# Altium schematic sheet [03] - CONNECTORS.SchDoc
size A4; DocumentNumber: 3; SheetNumber: 3; SheetTotal: 12
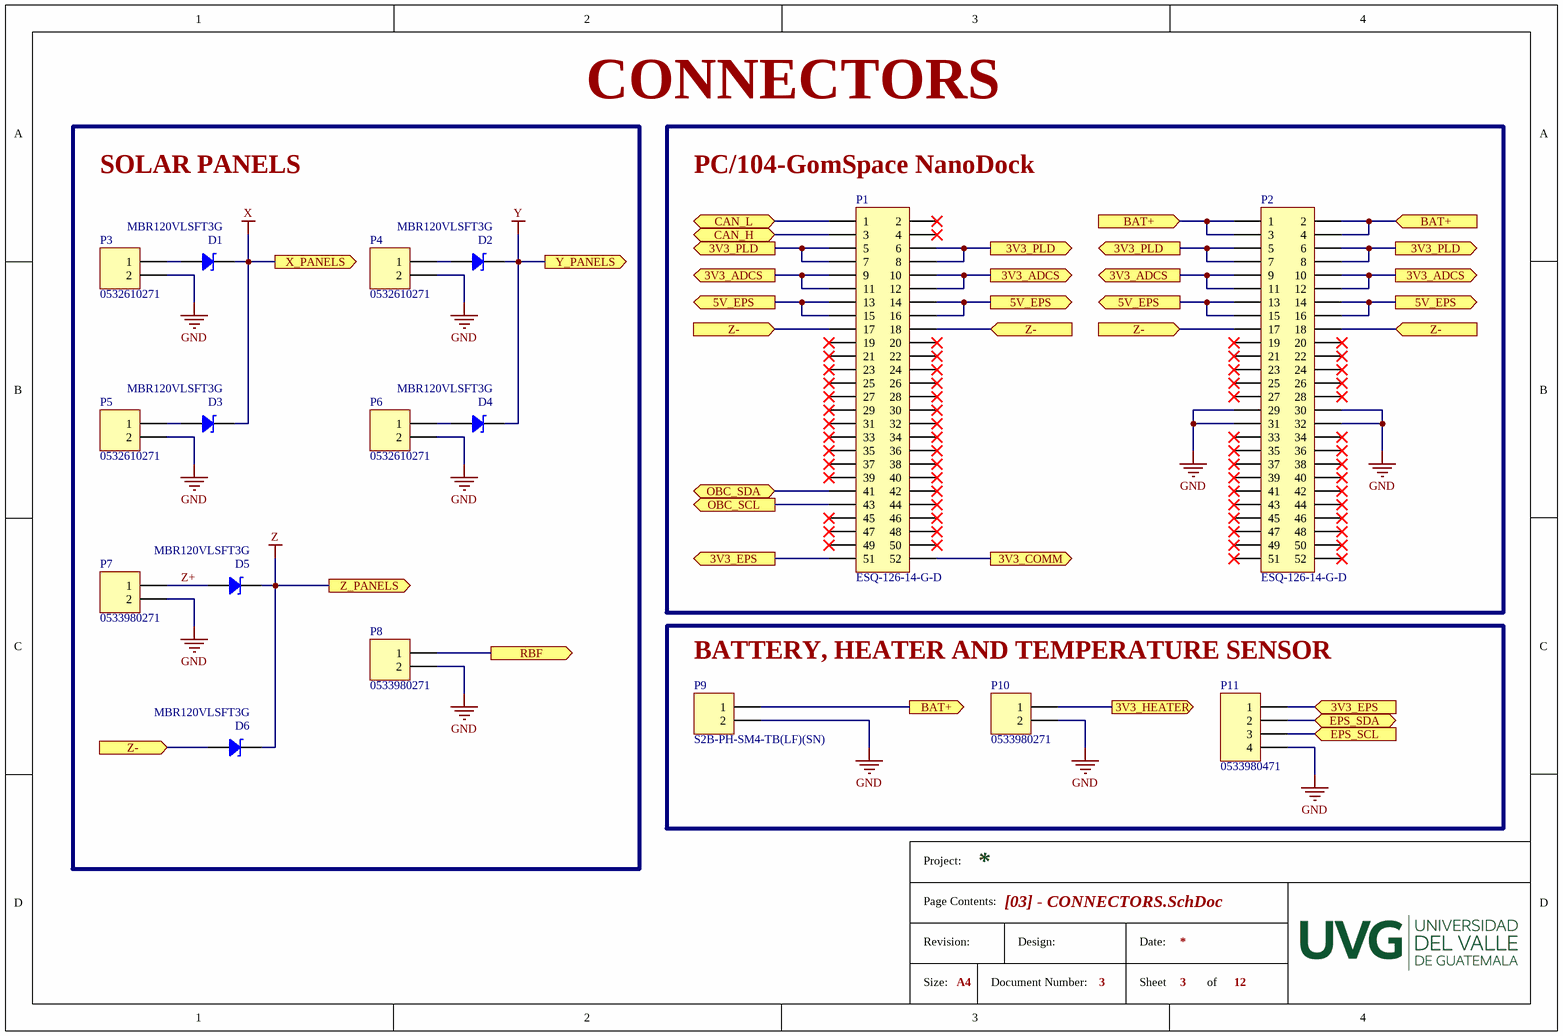
[diagram p0: [03] - CONNECTORS.SchDoc]

## Parts
D1  MBR120VLSFT3G  [SOD123F]
D2  MBR120VLSFT3G  [SOD123F]
D3  MBR120VLSFT3G  [SOD123F]
D4  MBR120VLSFT3G  [SOD123F]
D5  MBR120VLSFT3G  [SOD123F]
D6  MBR120VLSFT3G  [SOD123F]
P1  ESQ-126-14-G-D  [ESQ-126-14-G-D]
P2  ESQ-126-14-G-D  [ESQ-126-14-G-D]
P3  0532610271  [0532610271]
P4  0532610271  [0532610271]
P5  0532610271  [0532610271]
P6  0532610271  [0532610271]
P7  0533980271  [0533980271]
P8  0533980271  [0533980271]
P9  S2B-PH-SM4-TB(LF)(SN)  [S2B-PH-SM4-TB(LF)(SN)]
P10  0533980271  [0533980271]
P11  0533980471  [0533980471]

## Blocks framed on the sheet
CONNECTORS: D1-D6 P3-P8
PC/104-GomSpace NanoDock: P1 P2
BATTERY, HEATER AND TEMPERATURE SENSOR: P9-P11

## Ports
3V3_ADCS (out), 3V3_COMM (out), 3V3_EPS (in), 3V3_EPS (out), 3V3_HEATER (out), 3V3_PLD (out), 5V_EPS (out), BAT+ (in), BAT+ (out), CAN_H (bidir), CAN_L (bidir), EPS_SCL (in), EPS_SDA (bidir), OBC_SCL (out), OBC_SDA (bidir), RBF (out), X_PANELS (out), Y_PANELS (out), Z- (in), Z_PANELS (out)

## Nets
GND: P2.29 P2.30 P2.31 P2.32 P3.2 P4.2 P5.2 P6.2 P7.2 P8.2 P9.2 P10.2 P11.4
X: D1.2 D3.2 ; port X_PANELS
Y: D2.2 D4.2 ; port Y_PANELS
Z: D5.2 D6.2 ; port Z_PANELS
3V3_ADCS: P1.9 P1.10 P1.11 P1.12 P2.9 P2.10 P2.11 P2.12 ; port 3V3_ADCS
3V3_COMM: P1.52 ; port 3V3_COMM
3V3_EPS: P1.51 P11.1 ; port 3V3_EPS
3V3_HEATER: P10.1 ; port 3V3_HEATER
3V3_PLD: P1.5 P1.6 P1.7 P1.8 P2.5 P2.6 P2.7 P2.8 ; port 3V3_PLD
5V_EPS: P1.13 P1.14 P1.15 P1.16 P2.13 P2.14 P2.15 P2.16 ; port 5V_EPS
BAT+: P2.1 P2.2 P2.3 P2.4 P9.1 ; port BAT+
CAN_H: P1.3 ; port CAN_H
CAN_L: P1.1 ; port CAN_L
EPS_SCL: P11.3 ; port EPS_SCL
EPS_SDA: P11.2 ; port EPS_SDA
OBC_SCL: P1.43 ; port OBC_SCL
OBC_SDA: P1.41 ; port OBC_SDA
RBF: P8.1 ; port RBF
Z+: D5.1 P7.1
Z-: D6.1 P1.17 P1.18 P2.17 P2.18 ; port Z-
NetD1_1: D1.1 P3.1
NetD2_1: D2.1 P4.1
NetD3_1: D3.1 P5.1
NetD4_1: D4.1 P6.1

Not connected (* = marked no-connect by the designer): P1 2* 4* 19* 20* 21* 22* 23* 24* 25* 26* 27* 28* 29* 30* 31* 32* 33* 34* 35* 36* 37* 38* 39* 40* 42* 44* 45* 46* 47* 48* 49* 50*; P2 19* 20* 21* 22* 23* 24* 25* 26* 27* 28* 33* 34* 35* 36* 37* 38* 39* 40* 41* 42* 43* 44* 45* 46* 47* 48* 49* 50* 51* 52*

## Notes on the sheet
- SOLAR PANELS
- Project:
- Page Contents:
- Size:
- Revision:
- A4
- Document Number:
- Design:
- Date:
- Sheet
- of

## Library data of the parts
D1-D6 = MBR120VLSFT3G: DIODE SCHOTTKY 20V 1A SOD123FL; Manufacturer: ON Semiconductor; PCN Design/Specification: SOD123-FL Package Height 13/Sep/2013; Voltage - Forward (Vf) (Max) @ If: 340mV @ 1A; Speed: Fast Recovery =  200mA (Io); Current - Reverse Leakage @ Vr: 600µA @ 20V; Online Catalog: Schottky Diode; Other Names: MBR120VLSFT3GOSDKR; Supplier 1: Digi-Key; Manufacturer Part Number: MBR120VLSFT3G; Stock 1: 5944; Pricing 1: 1=0.42, 10=0.338, 100=0.2298, 500=0.1723, 1000=0.1293 (USD); Standard Package: 1; Category: Discrete Semiconductor Products; Family: Diodes, Rectifiers - Single; Series: -; Packaging: Digi-Reel®; Diode Type: Schottky; Voltage - DC Reverse (Vr) (Max): 20V; Current - Average Rectified (Io): 1A; Reverse Recovery Time (trr): -; Capacitance @ Vr, F: -; Mounting Type: Surface Mount; Package / Case: SOD-123F; Supplier Device Package: SOD-123FL; Operating Temperature - Junction: -65°C ~ 125°C; ComponentLink1URL: https://datasheet.ciiva.com/4715/mbr120vlsft1-d-107081-4715104.pdf; ComponentLink1Description: https://datasheet.ciiva.com/4715/mbr120vlsft1-d-107081-4715104.pdf; ComponentLink2URL: https://datasheet.ciiva.com/6380/mbr120vlsft1-d-6380907.pdf; ComponentLink2Description: https://datasheet.ciiva.com/6380/mbr120vlsft1-d-6380907.pdf; ComponentLink3URL: https://datasheet.ciiva.com/8294/mbr120vlsft1-d-8294603.pdf; ComponentLink3Description: https://datasheet.ciiva.com/8294/mbr120vlsft1-d-8294603.pdf; ComponentLink4URL: https://datasheet.ciiva.com/6380/mbr120vlsft1-d-6380910.pdf; ComponentLink4Description: https://datasheet.ciiva.com/6380/mbr120vlsft1-d-6380910.pdf; Supplier Part Number 1: MBR120VLSFT3GOSCT-ND
P1 P2 = ESQ-126-14-G-D: CONN SOCKET 52POS 0.1 GOLD PCB; Manufacturer: Samtec; Number of Contacts: 52; Gender: Receptacle; Max Current Rating: 6.9A; Contact Resistance: 10mR; Max Voltage Rating (AC): 550V; Pitch: 2.54mm; Supplier 1: Digi-Key; Manufacturer Part Number: ESQ-126-14-G-D; Stock 1: 520; Pricing 1: 1 = 9.64000, 10 = 8.91700, 100 = 7.47100, 500 = 6.26600, 1000 = 6.02500 (USD); RoHS: Yes; Contact Plating: Gold; Contact Material: Bronze; Housing Color: Black; Housing Material: Polyester; Min Operating Temperature: -55°C; Max Operating Temperature: 125°C; Number of Rows: 2; Termination: Solder; Packaging: Bulk; Orientation: Straight; Length: 66.55mm; Lead Pitch: 2.54mm; Depth: 4.95mm; Radiation Hardening: No; REACH SVHC: No SVHC; ComponentLink1URL: http://www.farnell.com/datasheets/1902536.pdf?src-supplier=Farnell; ComponentLink1Description: http://www.farnell.com/datasheets/1902536.pdf?src-supplier=Farnell; ComponentLink2URL: http://components.arrow.com/part/dataview/0323_04347871?src-supplier=Arrow+Europe; ComponentLink2Description: http://components.arrow.com/part/dataview/0323_04347871?src-supplier=Arrow+Europe; ComponentLink3URL: http://www.samtec.com/documents/webfiles/pdf/ESW_TH.PDF?src-supplier=Avnet+Europe; ComponentLink3Description: http://www.samtec.com/documents/webfiles/pdf/ESW_TH.PDF?src-supplier=Avnet+Europe; ComponentLink4URL: http://cloud.samtec.com/catalog_english/ESW_TH.PDF?src-supplier=Avnet; ComponentLink4Description: http://cloud.samtec.com/catalog_english/ESW_TH.PDF?src-supplier=Avnet; ComponentLink5URL: http://suddendocs.samtec.com/prints/esq-1xx-xx-x-x-xxx-xx-x-xx-mkt.pdf?src-supplier=Digi-Key; ComponentLink5Description: http://suddendocs.samtec.com/prints/esq-1xx-xx-x-x-xxx-xx-x-xx-mkt.pdf?src-supplier=Digi-Key; ComponentLink6URL: http://www.farnell.com/datasheets/1902536.pdf?src-supplier=Element14; ComponentLink6Description: http://www.farnell.com/datasheets/1902536.pdf?src-supplier=Element14; Supplier Part Number 1: SAM11114-ND
P3-P6 = 0532610271: CONN HEADER 2POS 1.25MM R/A SMD; Manufacturer: Molex; Manufacturer Part Number: 53261-0271; Voltage Rating: 125V; Gender: Male; Contact Resistance: 20mR; Current Rating: 1A; Number of Positions: 2; Insulation Resistance: 100MR; Glow Wire Compliant: Non-compliant; Supplier 1: Digi-Key; Stock 1: 34859; Pricing 1: 1 = 0.98000, 10 = 0.86000, 100 = 0.74170, 500 = 0.60688 (USD); RoHS: Yes; Mount: Surface Mount; Contact Material: Bronze; Contact Plating: Tin; Color: Beige; Housing Material: Thermoplastic; Min Operating Temperature: -40°C; Max Operating Temperature: 85°C; Packaging: Tape and Reel; Termination: SMD/SMT; Package Quantity: 1000; Number of Rows: 1; Number of Contacts: 2; Orientation: Right Angle; Voltage Rating (AC): 125V; Working Voltage: 125V; Number of Circuits: 2; Voltage Rating (DC): 125V; Pitch: 1.25mm; Lead Pitch: 1.25mm; Radiation Hardening: No; REACH SVHC: Unknown; Lead Free: Lead Free; Flammability Rating: UL94 V-0; ComponentLink1URL: https://datasheet.ciiva.com/11747/0900766b8078fc90-11747475.pdf?src-supplier=RSComponents; ComponentLink1Description: https://datasheet.ciiva.com/11747/0900766b8078fc90-11747475.pdf?src-supplier=RSComponents; ComponentLink2URL: https://datasheet.ciiva.com/5151/0532610271-pcb-headers-171053-5151611.pdf?src-supplier=Mouser; ComponentLink2Description: https://datasheet.ciiva.com/5151/0532610271-pcb-headers-171053-5151611.pdf?src-supplier=Mouser; ComponentLink3URL: https://datasheet.ciiva.com/7167/1626147-7167496.pdf?src-supplier=Newark; ComponentLink3Description: https://datasheet.ciiva.com/7167/1626147-7167496.pdf?src-supplier=Newark; ComponentLink4URL: https://datasheet.ciiva.com/30193/198270532610271-pcb-headers-30193321.pdf?src-supplier=Onlinecomponents.com; ComponentLink4Description: https://datasheet.ciiva.com/30193/198270532610271-pcb-headers-30193321.pdf?src-supplier=Onlinecomponents.com; ComponentLink5URL: https://datasheet.ciiva.com/34303/1932547-34303342.pdf?src-supplier=Jameco; ComponentLink5Description: https://datasheet.ciiva.com/34303/1932547-34303342.pdf?src-supplier=Jameco; ComponentLink6URL: https://datasheet.ciiva.com/16658/0532610271-pcb-headers-16658423.pdf?src-supplier=Avnet+Europe; ComponentLink6Description: https://datasheet.ciiva.com/16658/0532610271-pcb-headers-16658423.pdf?src-supplier=Avnet+Europe; ComponentLink7URL: https://datasheet.ciiva.com/17035/70091115-17035863.pdf?src-supplier=Allied+Electronics; ComponentLink7Description: https://datasheet.ciiva.com/17035/70091115-17035863.pdf?src-supplier=Allied+Electronics; ComponentLink8URL: https://datasheet.ciiva.com/46393/1808526-46393547.pdf?src-supplier=Element14; ComponentLink8Description: https://datasheet.ciiva.com/46393/1808526-46393547.pdf?src-supplier=Element14; ComponentLink9URL: https://datasheet.ciiva.com/7920/1887027-7920826.pdf?src-supplier=Element14; ComponentLink9Description: https://datasheet.ciiva.com/7920/1887027-7920826.pdf?src-supplier=Element14; ComponentLink10URL: https://datasheet.ciiva.com/9468/0532610271-pcb-headers-9468506.pdf?src-supplier=Avnet; ComponentLink10Description: https://datasheet.ciiva.com/9468/0532610271-pcb-headers-9468506.pdf?src-supplier=Avnet; ComponentLink11URL: https://datasheet.ciiva.com/22683/1626147-22683562.pdf?src-supplier=Element14; ComponentLink11Description: https://datasheet.ciiva.com/22683/1626147-22683562.pdf?src-supplier=Element14; Supplier Part Number 1: WM7620CT-ND
P7 P8 P10 = 0533980271: CONN HEADER 2POS 1.25MM VERT SMD; Manufacturer: Molex; Connector Type: Header, Shrouded; Number of Positions: 2; Number of Positions Loaded: All; Pitch: 0.049" (1.25mm); Supplier 1: Digi-Key; Manufacturer Part Number: 0533980271; Stock 1: 25214; Pricing 1: 1=0.88, 10=0.778, 100=0.6713, 500=0.5493 (USD); Category: Connectors, Interconnects; Family: Rectangular Connectors - Headers, Male Pins; Series: PicoBlade™ 53398; Packaging: Cut Tape (CT); Contact Type: Blade Pin; Number of Rows: 1; Row Spacing: -; Contact Mating Length: -; Mounting Type: Surface Mount; Termination: Solder; Fastening Type: -; Features: Solder Retention; Contact Finish: Tin; Contact Finish Thickness: 39µin (1.00µm); Color: Natural; ComponentLink1URL: https://datasheet.ciiva.com/6813/533980271-sd-6813860.pdf; ComponentLink1Description: https://datasheet.ciiva.com/6813/533980271-sd-6813860.pdf; ComponentLink2URL: https://datasheet.ciiva.com/3117/0533980271-pcb-headers-3117624.pdf; ComponentLink2Description: https://datasheet.ciiva.com/3117/0533980271-pcb-headers-3117624.pdf; ComponentLink3URL: https://datasheet.ciiva.com/3117/0533980271-pcb-headers-3117625.pdf; ComponentLink3Description: https://datasheet.ciiva.com/3117/0533980271-pcb-headers-3117625.pdf; ComponentLink4URL: https://datasheet.ciiva.com/6813/533980271-sd-6813869.pdf; ComponentLink4Description: https://datasheet.ciiva.com/6813/533980271-sd-6813869.pdf; Supplier Part Number 1: WM7606CT-ND
P9 = S2B-PH-SM4-TB(LF)(SN): CONN HEADER PH SIDE 2POS 2MM SMD; Manufacturer: JST; No of Positions: 2; Style/Orientation: Right Angle Header/Plug; Supplier 1: Digi-Key; Manufacturer Part Number: S2B-PH-SM4-TB(LF)(SN); Stock 1: 113530; Pricing 1: 1=0.58, 10=0.547, 100=0.4194, 500=0.3647 (USD); Pitch: 2 mm; Type: Shrouded Header; Termination: Crimp; ComponentLink1URL: https://datasheet.ciiva.com/11747/0900766b80df0d9d-11747104.pdf; ComponentLink1Description: https://datasheet.ciiva.com/11747/0900766b80df0d9d-11747104.pdf; ComponentLink2URL: https://datasheet.ciiva.com/712/eph-712514.pdf; ComponentLink2Description: https://datasheet.ciiva.com/712/eph-712514.pdf; ComponentLink3URL: https://datasheet.ciiva.com/712/eph-712515.pdf; ComponentLink3Description: https://datasheet.ciiva.com/712/eph-712515.pdf; ComponentLink4URL: https://datasheet.ciiva.com/712/eph-712516.pdf; ComponentLink4Description: https://datasheet.ciiva.com/712/eph-712516.pdf; ComponentLink5URL: https://datasheet.ciiva.com/16199/s2b-ph-sm4-tblfsn-16199686.pdf; ComponentLink5Description: https://datasheet.ciiva.com/16199/s2b-ph-sm4-tblfsn-16199686.pdf; ComponentLink6URL: https://datasheet.ciiva.com/26894/getdatasheetpartid-406256-26894907.pdf; ComponentLink6Description: https://datasheet.ciiva.com/26894/getdatasheetpartid-406256-26894907.pdf; Supplier Part Number 1: 455-1749-1-ND
P11 = 0533980471: CONN HEADER 4POS 1.25MM VERT SMD; Manufacturer: Molex; Manufacturer Part Number: 53398-0471; Body Plating: Tin; Gender: Male; Current Rating: 1A; Voltage Rating: 125V; Number of Positions: 4; Contact Resistance: 20mR; Insulation Resistance: 100MR; Glow Wire Compliant: Non-compliant; Supplier 1: Digi-Key; Stock 1: 49208; Pricing 1: 1=1.19, 10=1.044, 100=0.901, 500=0.73716 (USD); Mount: Surface Mount; Colour: Natural; Housing Colour: Natural; Housing Material: Nylon; Contact Plating: Tin; Contact Material: Bronze,Brass,Tin; Min Operating Temperature: -40°C; Max Operating Temperature: 85°C; Packaging: Tape and Reel; Termination: Solder; Number of Rows: 1; Package Quantity: 1000; Number of Contacts: 4; Orientation: Vertical; Voltage Rating (AC): 125V; Working Voltage: 125V; Number of Circuits: 4; Voltage Rating (DC): 125V; Pitch: 1.25mm; Lead Pitch: 1.25mm; Radiation Hardening: No; REACH SVHC: Unknown; Lead Free: Lead Free; Flammability Rating: UL94 V-0; ComponentLink1URL: https://datasheet.ciiva.com/5154/0533980471-pcb-headers-171069-5154864.pdf; ComponentLink1Description: https://datasheet.ciiva.com/5154/0533980471-pcb-headers-171069-5154864.pdf; ComponentLink2URL: https://datasheet.ciiva.com/39121/1932627-39121616.pdf; ComponentLink2Description: https://datasheet.ciiva.com/39121/1932627-39121616.pdf; ComponentLink3URL: https://datasheet.ciiva.com/23964/0533980471-pcb-headers-23964130.pdf; ComponentLink3Description: https://datasheet.ciiva.com/23964/0533980471-pcb-headers-23964130.pdf; ComponentLink4URL: https://datasheet.ciiva.com/14156/gf116833-116846-e-14156245.pdf; ComponentLink4Description: https://datasheet.ciiva.com/14156/gf116833-116846-e-14156245.pdf; ComponentLink5URL: https://datasheet.ciiva.com/28592/0533980471-pcb-headers-28592022.pdf; ComponentLink5Description: https://datasheet.ciiva.com/28592/0533980471-pcb-headers-28592022.pdf; ComponentLink6URL: https://datasheet.ciiva.com/22700/1841151-22700615.pdf; ComponentLink6Description: https://datasheet.ciiva.com/22700/1841151-22700615.pdf; ComponentLink7URL: https://datasheet.ciiva.com/30178/225160533980471-pcb-headers-30178167.pdf; ComponentLink7Description: https://datasheet.ciiva.com/30178/225160533980471-pcb-headers-30178167.pdf; ComponentLink8URL: https://datasheet.ciiva.com/11748/0900766b80ab946a-11748472.pdf; ComponentLink8Description: https://datasheet.ciiva.com/11748/0900766b80ab946a-11748472.pdf; ComponentLink9URL: https://datasheet.ciiva.com/31408/0533980471-pcb-headers-31408393.pdf; ComponentLink9Description: https://datasheet.ciiva.com/31408/0533980471-pcb-headers-31408393.pdf; ComponentLink10URL: https://datasheet.ciiva.com/46384/1788582-46384012.pdf; ComponentLink10Description: https://datasheet.ciiva.com/46384/1788582-46384012.pdf; ComponentLink11URL: https://datasheet.ciiva.com/9468/0533980471-pcb-headers-9468286.pdf; ComponentLink11Description: https://datasheet.ciiva.com/9468/0533980471-pcb-headers-9468286.pdf; ComponentLink12URL: https://datasheet.ciiva.com/16658/0533980471-pcb-headers-16658431.pdf; ComponentLink12Description: https://datasheet.ciiva.com/16658/0533980471-pcb-headers-16658431.pdf; Supplier Part Number 1: WM7608CT-ND